# EAGLE design Esquema 01 guilherme (EAGLE 9.6.2)
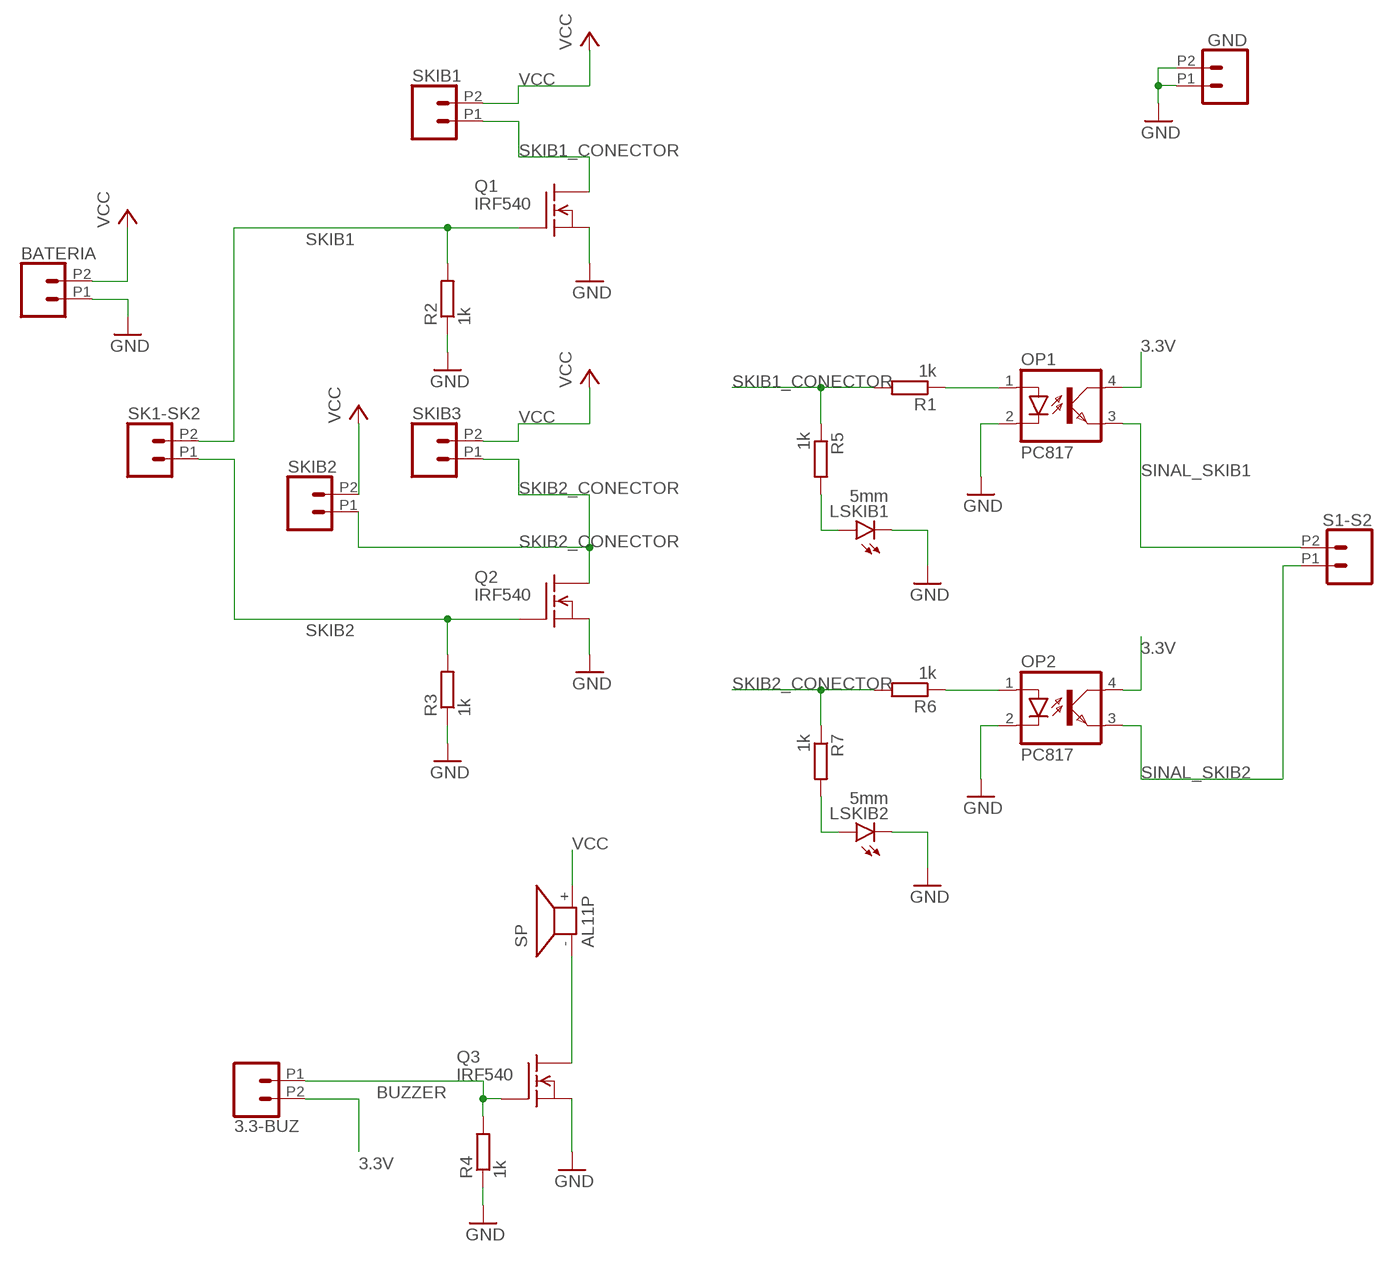
[diagram p0: schematic, sheet 1]

## Parts
3.3-BUZ  CONN_022.54MM_SCREWTERM  [1X02_2.54_SCREWTERM]
BATERIA  CONN_022.54MM_SCREWTERM  [1X02_2.54_SCREWTERM]
GND  CONN_022.54MM_SCREWTERM  [1X02_2.54_SCREWTERM]
LSKIB1  5mm  LED5MM  [LED5MM]
LSKIB2  5mm  LED5MM  [LED5MM]
OP1  PC817  [DIL04]
OP2  PC817  [DIL04]
Q1  IRF540  [TO220]
Q2  IRF540  [TO220]
Q3  IRF540  [TO220]
R1  1k  R-EU_0207/10  [0207/10]
R2  1k  R-EU_0207/10  [0207/10]
R3  1k  R-EU_0207/10  [0207/10]
R4  1k  R-EU_0207/10  [0207/10]
R5  1k  R-EU_0207/10  [0207/10]
R6  1k  R-EU_0207/10  [0207/10]
R7  1k  R-EU_0207/10  [0207/10]
S1-S2  CONN_022.54MM_SCREWTERM  [1X02_2.54_SCREWTERM]
SK1-SK2  CONN_022.54MM_SCREWTERM  [1X02_2.54_SCREWTERM]
SKIB1  CONN_022.54MM_SCREWTERM  [1X02_2.54_SCREWTERM]
SKIB2  CONN_022.54MM_SCREWTERM  [1X02_2.54_SCREWTERM]
SKIB3  CONN_022.54MM_SCREWTERM  [1X02_2.54_SCREWTERM]
SP  AL11P  [AL11P]

## Nets
3.3V: 3.3-BUZ.P2 OP1.4(COL) OP2.4(COL)
BUZZER: 3.3-BUZ.P1 Q3.1(G) R4.2
GND: BATERIA.P1 GND.P1 GND.P2 LSKIB1.K(C) LSKIB2.K(C) OP1.2(C) OP2.2(C) Q1.3(S) Q2.3(S) Q3.3(S) R2.1 R3.1 R4.1
N$1: LSKIB2.A R7.2
N$2: Q3.2(D) SP.-
N$3: LSKIB1.A R5.2
N$4: OP1.1(A) R1.1
N$5: OP2.1(A) R6.1
SINAL_SKIB1: OP1.3(EMIT) S1-S2.P2
SINAL_SKIB2: OP2.3(EMIT) S1-S2.P1
SKIB1: Q1.1(G) R2.2 SK1-SK2.P2
SKIB1_CONECTOR: Q1.2(D) R1.2 R5.1 SKIB1.P1
SKIB2: Q2.1(G) R3.2 SK1-SK2.P1
SKIB2_CONECTOR: Q2.2(D) R6.2 R7.1 SKIB2.P1 SKIB3.P1
VCC: BATERIA.P2 SKIB1.P2 SKIB2.P2 SKIB3.P2 SP.+

## Library data of the parts
3.3-BUZ BATERIA GND S1-S2 SK1-SK2 SKIB1-SKIB3 = SparkFun-Connectors:CONN_02: Multi connection point. Often used as Generic Header-pin footprint for 0.1 inch spaced/style header connections On any of the 0.1 inch spaced packages, you can populate with these: Break Away Headers - Straight <https://www.sparkfun.com/products/116> (PRT-00116) Break Away Male Headers - Right Angle <https://www.sparkfun.com/products/553> (PRT-00553) Female Headers <https://www.sparkfun.com/products/115> (PRT-00115) Break Away Headers - Machine Pin <https://www.sparkfun.com/products/117> (PRT-00117) Break Away Female Headers - Swiss Machine Pin <https://www.sparkfun.com/products/743> (PRT-00743) For SCREWTERMINALS and SPRING TERMINALS visit here: Screw Terimnals on SparkFun.com <https://www.sparkfun.com/search/results?term=Screw+Terminals> (5mm/3.5mm/2.54mm spacing) This device is also useful as a general connection point to wire up your design to another part of your project. Our various solder wires solder well into these plated through hole pads. Hook-Up Wire - Assortment (Stranded, 22 AWG) <https://www.sparkfun.com/products/11375> (PRT-11375) Hook-Up Wire - Assortment (Solid Core, 22 AWG) <https://www.sparkfun.com/products/11367> (PRT-11367) View the entire wire category on our website here <https://www.sparkfun.com/categories/141> Special notes: Molex polarized connector foot print use with: PRT-08233 with associated crimp pins and housings. 2.54_SCREWTERM for use with PRT-10571. 3.5mm Screw Terminal footprints for PRT-08084 5mm Screw Terminal footprints for use with PRT-08432
LSKIB1 LSKIB2 = led:LED: LED OSRAM: - CHIPLED LG R971, LG N971, LY N971, LG Q971, LY Q971, LO R971, LY R971 LH N974, LH R974 LS Q976, LO Q976, LY Q976 LO Q996 - Hyper CHIPLED LW Q18S LB Q993, LB Q99A, LB R99A - SideLED LS A670, LO A670, LY A670, LG A670, LP A670 LB A673, LV A673, LT A673, LW A673 LH A674 LY A675 LS A676, LA A676, LO A676, LY A676, LW A676 LS A679, LY A679, LG A679 - Hyper Micro SIDELED® LS Y876, LA Y876, LO Y876, LY Y876 LT Y87S - SmartLED LW L88C, LW L88S LB L89C, LB L89S, LG L890 LS L89K, LO L89K, LY L89K LS L896, LA L896, LO L896, LY L896 - TOPLED LS T670, LO T670, LY T670, LG T670, LP T670 LSG T670, LSP T670, LSY T670, LOP T670, LYG T670 LG T671, LOG T671, LSG T671 LB T673, LV T673, LT T673, LW T673 LH T674 LS T676, LA T676, LO T676, LY T676, LB T676, LH T676, LSB T676, LW T676 LB T67C, LV T67C, LT T67C, LS T67K, LO T67K, LY T67K, LW E67C LS E67B, LA E67B, LO E67B, LY E67B, LB E67C, LV E67C, LT E67C LW T67C LS T679, LY T679, LG T679 LS T770, LO T770, LY T770, LG T770, LP T770 LB T773, LV T773, LT T773, LW T773 LH T774 LS E675, LA E675, LY E675, LS T675 LS T776, LA T776, LO T776, LY T776, LB T776 LHGB T686 LT T68C, LB T68C - Hyper Mini TOPLED® LB M676 - Mini TOPLED Santana® LG M470 LS M47K, LO M47K, LY M47K Source: http://www.osram.convergy.de LUXEON: - LUMILED® LXK2-PW12-R00, LXK2-PW12-S00, LXK2-PW14-U00, LXK2-PW14-V00 LXK2-PM12-R00, LXK2-PM12-S00, LXK2-PM14-U00 LXK2-PE12-Q00, LXK2-PE12-R00, LXK2-PE12-S00, LXK2-PE14-T00, LXK2-PE14-U00 LXK2-PB12-K00, LXK2-PB12-L00, LXK2-PB12-M00, LXK2-PB14-N00, LXK2-PB14-P00, LXK2-PB14-Q00 LXK2-PR12-L00, LXK2-PR12-M00, LXK2-PR14-Q00, LXK2-PR14-R00 LXK2-PD12-Q00, LXK2-PD12-R00, LXK2-PD12-S00 LXK2-PH12-R00, LXK2-PH12-S00 LXK2-PL12-P00, LXK2-PL12-Q00, LXK2-PL12-R00 Source: www.luxeon.com KINGBRIGHT: KA-3528ASYC Source: www.kingbright.com
OP1 OP2 = optocoupler:PC817: SHARP OPTO COUPLER; MPN: PC817X4J000F; OC_FARNELL: 9707727; OC_NEWARK: 97K7059
Q1-Q3 = transistor-fet:IRF540: N-Channel Enhancement MOSFET (HEXFET); 100V; 28A; 0,077Ohm
R1-R7 = rcl:R-EU_: RESISTOR, European symbol; SPICEPREFIX: R
SP = buzzer:AL11P: SPEAKER Source: Buerklin; OC_FARNELL: unknown; OC_NEWARK: unknown

## Board
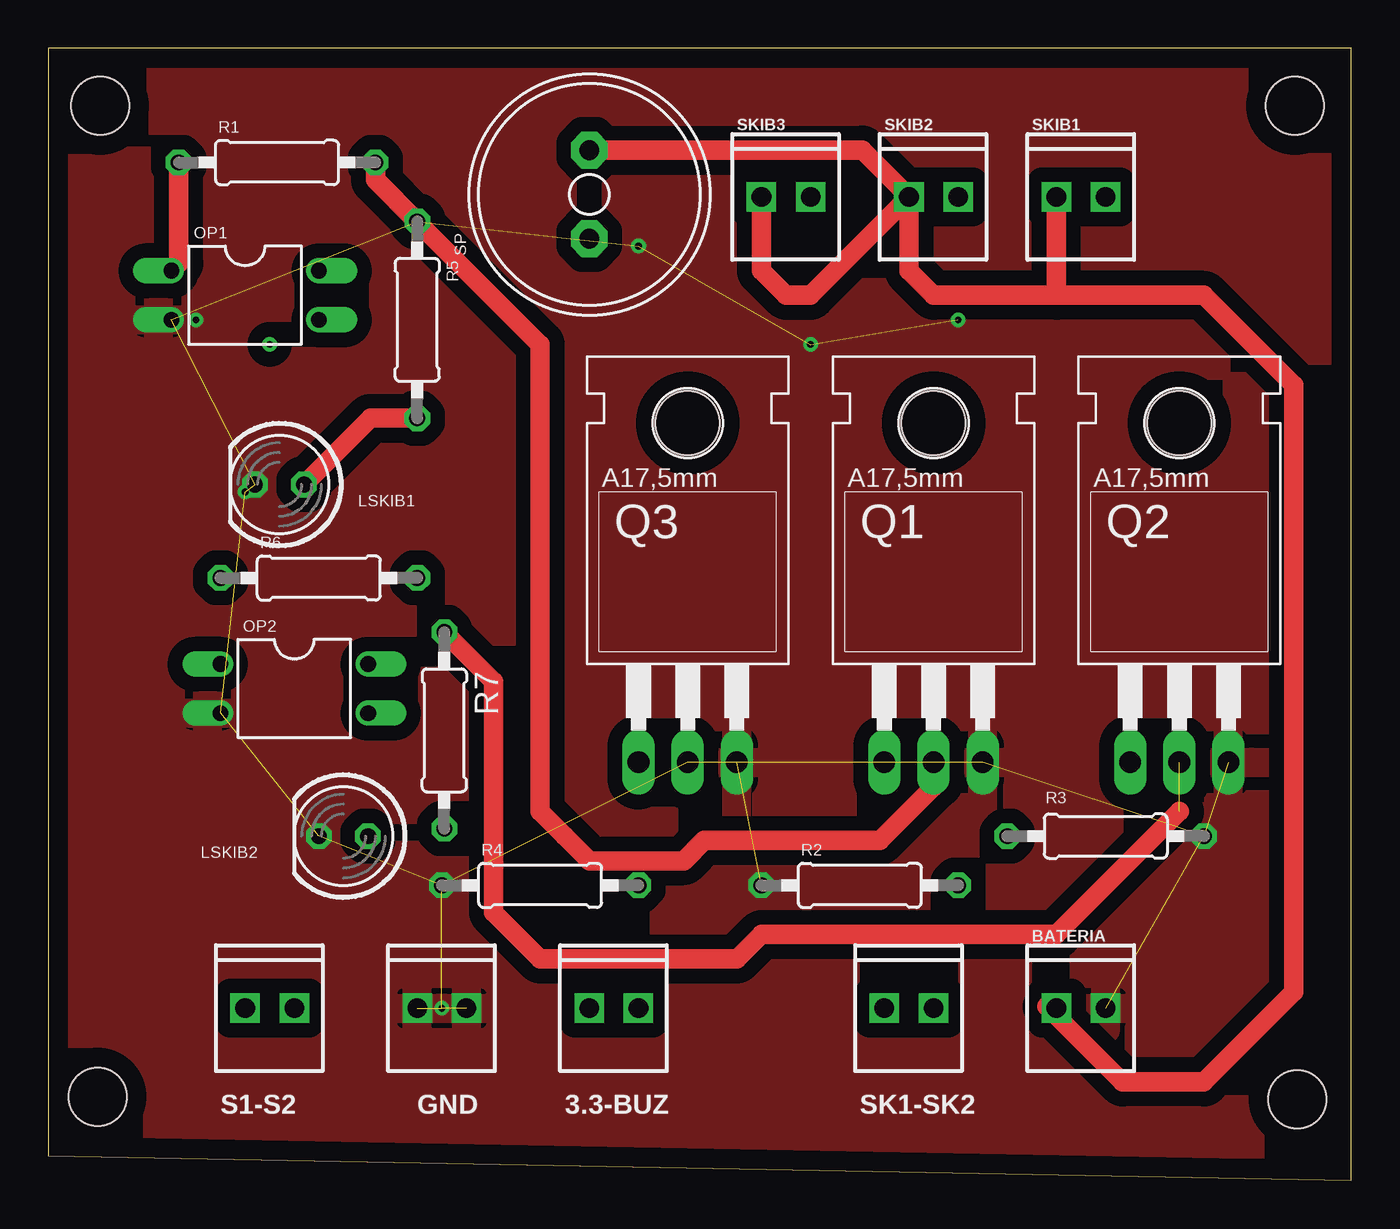
[diagram p1: board, top side]
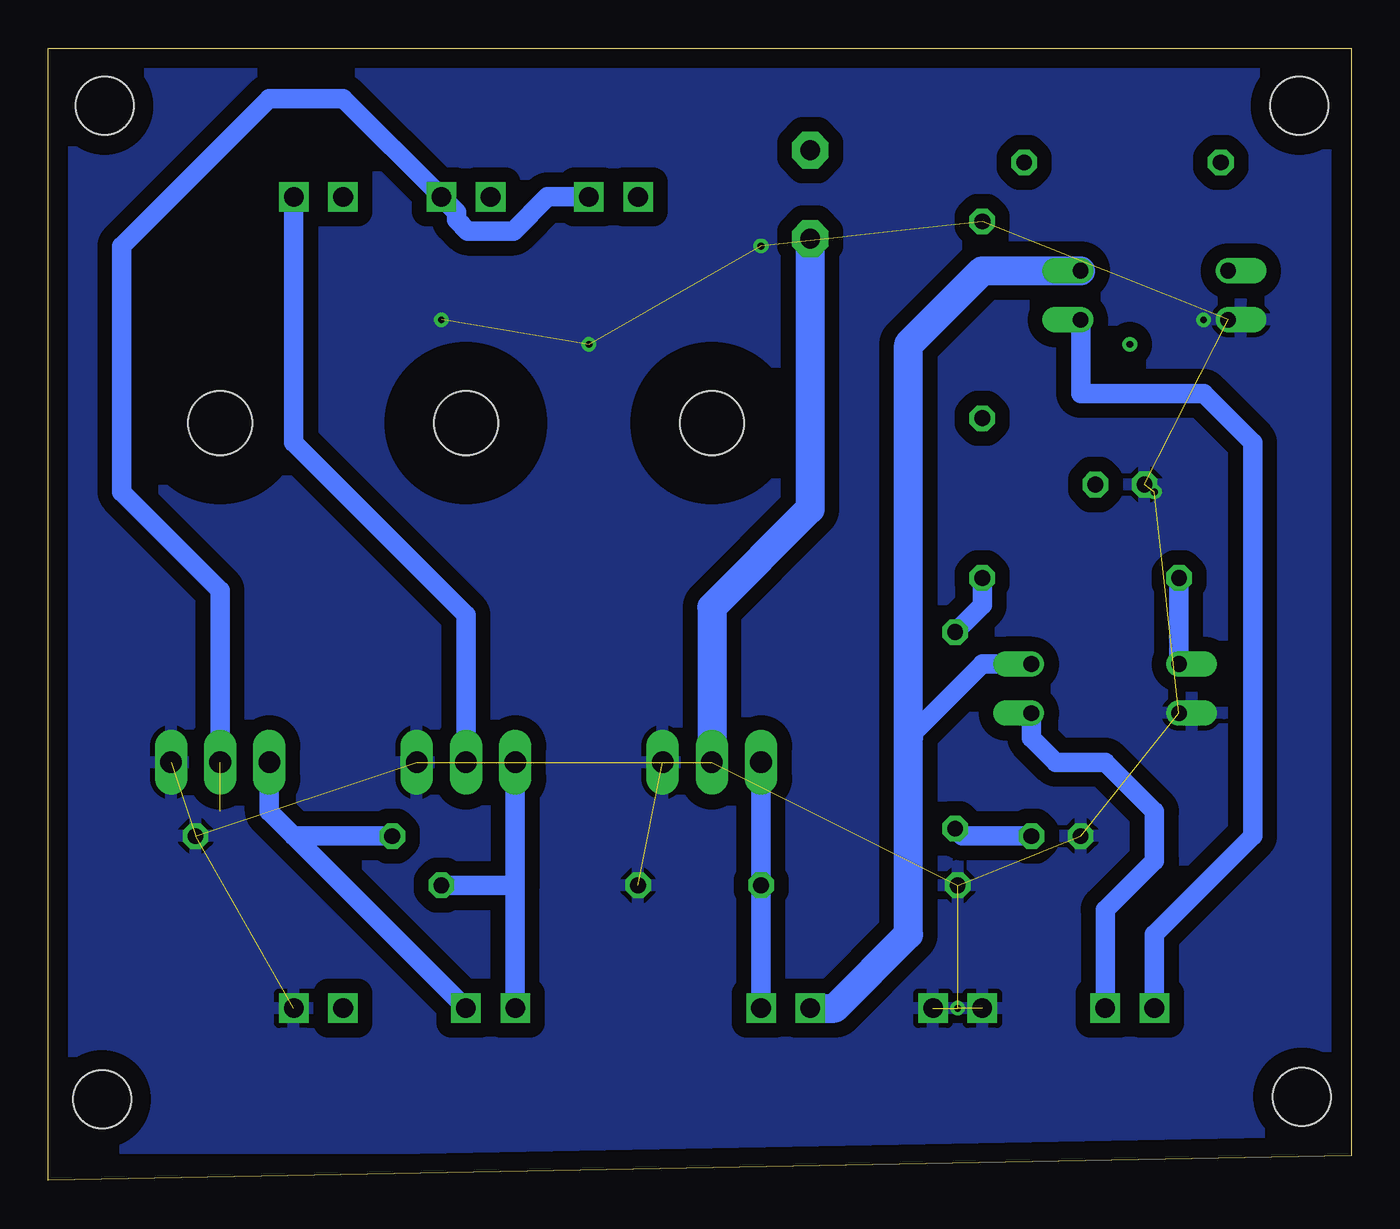
[diagram p2: board, bottom side, seen from below]

Size 67.29 x 58.47 mm. Coordinates in mm from the lower left corner, seen from the top.
Outline: 0,1.27 67.29,0 67.29,58.47 0,58.47 0,1.27
Copper layers (1*16): Top 0.035mm / dielectric 1.5mm / Bottom 0.035mm
Design rules "default *": minimum track width 1mm, minimum drill 0.35mm, track to track 30mil, track to pad 0.5mm, pad to pad 6mil, via to via 6mil, smd to smd 6mil, copper to edge 40mil, drill to drill 6mil, minimum pad ring 10mil, minimum via ring 8mil, stop-mask expansion 4mil, vias tented up to drill 1mm, thermal gap 10mil
Holes 3 mm at 2.67,55.5 64.39,55.5 2.54,4.32 64.52,4.19

### Footprints (pad centres in the part's own frame; a part is rotated, then mirrored left to right if it is on the bottom)
1X02_2.54_SCREWTERM = drill 1.016 square: P1 2.54,0; P2 0,0
LED5MM = drill 0.813 octagon: A -1.27,0; K 1.27,0
DIL04 = drill 0.813 offset: 1 -1.27,-3.81; 2 1.27,-3.81; 3 1.27,3.81; 4 -1.27,3.81
TO220 = drill 1.118 long: 1 -2.54,-6.35; 2 0,-6.35; 3 2.54,-6.35 | hole 3.302: 0,11.176
0207/10 = drill 0.813 octagon: 1 -5.08,0; 2 5.08,0
AL11P = drill 1.016 pad 1.905 octagon: + 2.286,0; - -2.286,0

### Placement (x,y rotation side)
3.3-BUZ  27.94,8.89 0 top
BATERIA  52.07,8.89 0 top
GND  19.05,8.89 0 top
LSKIB1  11.94,35.94 180 top
LSKIB2  15.24,17.78 180 top
OP1  10.16,45.72 270 top
OP2  12.7,25.4 270 top
Q1  45.72,27.94 0 top
Q2  58.42,27.94 0 top
Q3  33.02,27.94 0 top
R1  11.81,52.58 0 top
R2  41.91,15.24 0 top
R3  54.61,17.78 180 top
R4  25.4,15.24 0 top
R5  19.05,44.45 270 top
R6  13.97,31.11 0 top
R7  20.45,23.24 270 top
S1-S2  10.16,8.89 0 top
SK1-SK2  43.18,8.89 0 top
SKIB1  52.07,50.8 0 top
SKIB2  44.45,50.8 0 top
SKIB3  36.83,50.8 0 top
SP  27.94,50.93 90 top

### Tracks (layer width: path | path; a pad name or v marks a point on that pad's centre or on a via)
3.3V
  Bottom 1: 22.86,22.86 19.05,26.67 OP2.4
  Bottom 1.5: 3.3-BUZ.P2 26.67,8.89 22.86,12.7 22.86,22.86 22.86,43.18 19.05,46.99 OP1.4
BUZZER
  Bottom 1: 3.3-BUZ.P1 R4.2 Q3.1
GND  (via drill 0.35)  (19 unrouted)
  other vias: 20.32,8.89 20.32,8.89 10.16,35.56 7.62,44.45 19.05,49.53 30.48,48.26 46.99,44.45 33.02,21.59 39.37,43.18 35.56,21.59 48.26,21.59 59.69,17.78 36.83,15.24 10.16,35.56
  pour Bottom: 0.38,58.04 0.38,1.65 66.93,1.65 66.93,58.04
  pour Top: 0,58.42 67.31,58.42 67.31,1.27 0,1.27
N$1
  Bottom 1: R7.2 20.07,17.78 LSKIB2.A
N$2
  Bottom 1.5: SP.- 27.94,34.67 33.02,29.59 Q3.2
N$3
  Top 1: LSKIB1.A 16.64,39.37 R5.2
N$4
  Top 1: OP1.1 6.73,47.37 R1.1
N$5
  Bottom 1: OP2.1 R6.1
N$8  (via drill 0.35)
  other vias: 11.43,43.18
SINAL_SKIB1
  Bottom 1: OP1.3 13.97,40.64 7.62,40.64 5.08,38.1 5.08,17.78 10.16,12.7 S1-S2.P2
SINAL_SKIB2
  Bottom 1: OP2.3 16.51,22.86 15.24,21.59 12.7,21.59 10.16,19.05 10.16,16.51 12.7,13.97 S1-S2.P1
SKIB1
  Bottom 1: SK1-SK2.P2 43.18,15.24
  Bottom 1.016: R2.2 43.18,15.24 Q1.1
SKIB1_CONECTOR
  Top 1: R1.2 16.89,51.69 R5.1 25.4,43.18 25.4,19.05 26.67,17.78
  Top 1.016: 26.67,17.78 27.94,16.51 32.82,16.51 33.86,17.55 42.95,17.55 45.72,20.32 Q1.2
  Bottom 1: SKIB1.P1 54.61,38.1 45.72,29.21 Q1.2
SKIB2
  Bottom 1: Q2.1 55.88,19.05 54.61,17.78 SK1-SK2.P1
  Bottom 1.016: R3.2 54.61,17.78
SKIB2_CONECTOR  (1 unrouted)
  Top 1: 58.42,19.05 52.07,12.7 36.83,12.7 35.56,11.43 25.4,11.43 22.99,13.84 22.99,25.78 R7.1
  Bottom 1: R7.1 19.05,29.72 R6.2 | Q2.2 58.42,30.48 63.5,35.56 63.5,48.26 55.88,55.88 52.07,55.88 SKIB2.P1 46.21,50.02 46.21,49.62 45.63,49.04 43.27,49.04 41.51,50.8 SKIB3.P1
VCC
  Top 1: SP.+ 42.04,53.21 SKIB2.P2 | BATERIA.P2 51.98,8.98 51.58,8.98 55.48,5.08 59.69,5.08 64.34,9.73 64.34,41.07 59.69,45.72 52.07,45.72 | 52.07,45.72 SKIB1.P2 | SKIB2.P2 44.45,46.99 45.72,45.72 52.07,45.72 | SKIB2.P2 39.37,45.72 38.1,45.72 36.83,46.99 SKIB3.P2